# Altium project Juhtmevaba_arvutihiir.PrjPcb
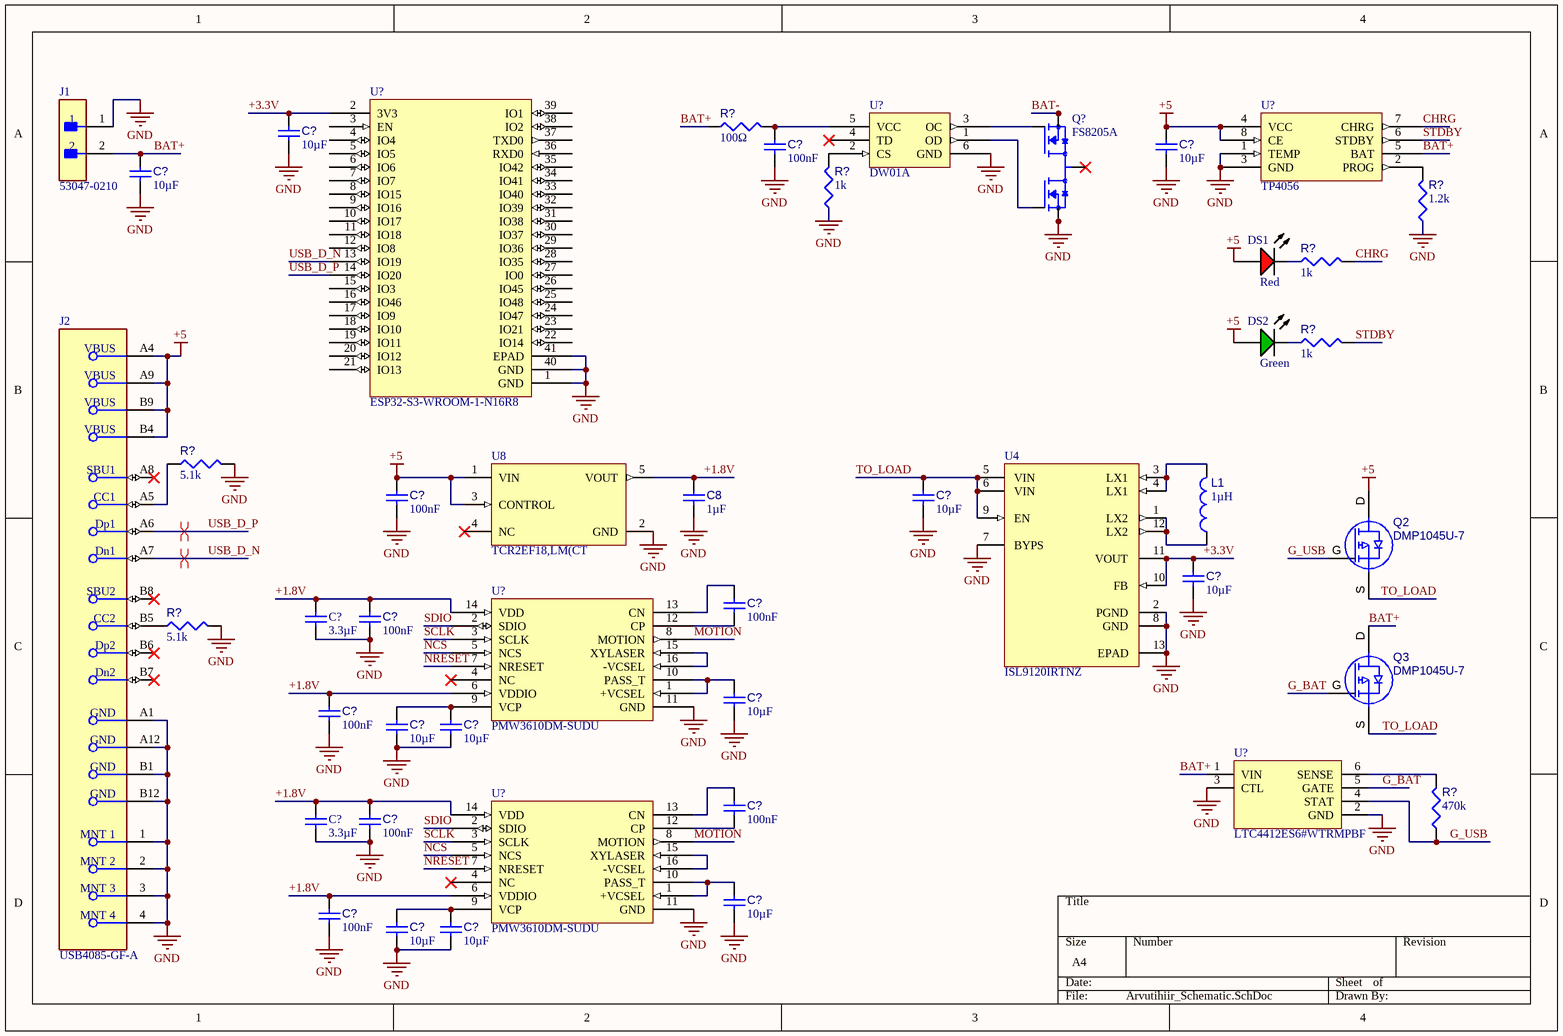
[diagram p0: Arvutihiir_Schematic.SchDoc]
1 sheet, 46 parts. Net scope: global (net labels, ports and power ports of the same name join across sheets).

## Sheet Arvutihiir_Schematic.SchDoc
size A4; SheetNumber: 1; SheetTotal: 1

### Parts
(Parts that share a designator on the sheet are numbered #1, #2 ... from top to bottom, then left to right.)
C8  value 1µF  [CAPC3216X180X50NL20T25]  (hidden comment: Capacitor 10 uF +/- 10% 16 V 1206)
C?#1  value 10µF  [CAPC0603(1608)100_L]  (hidden comment: Capacitor 10µF 0603)
C?#2  value 100nF  [CAPC1608X90X40ML10T20]  (hidden comment: Capacitor 100 nF +/-10% 50 V 0603)
C?#3  value 10µF  [CAPC0603(1608)100_L]  (hidden comment: Capacitor 10µF 0603)
C?#4  value 10µF  [CAPC0603(1608)100_L]  (hidden comment: Capacitor 10µF 0603)
C?#5  value 100nF  [CAPC1608X90X40ML10T20]  (hidden comment: Capacitor 100 nF +/-10% 50 V 0603)
C?#6  value 10µF  [CAPC0603(1608)100_L]  (hidden comment: Capacitor 10µF 0603)
C?#7  value 10µF  [CAPC0603(1608)100_L]  (hidden comment: Capacitor 10µF 0603)
C?#8  value 3.3µF  [CAPC1608X90X35ML15T15]  (hidden comment: Capacitor 3.3 µF 0603)
C?#9  value 100nF  [CAPC1608X90X40ML10T20]  (hidden comment: Capacitor 100 nF +/-10% 50 V 0603)
C?#10  value 100nF  [CAPC1608X90X40ML10T20]  (hidden comment: Capacitor 100 nF +/-10% 50 V 0603)
C?#11  value 10µF  [CAPC0603(1608)100_L]  (hidden comment: Capacitor 10µF 0603)
C?#12  value 100nF  [CAPC1608X90X40ML10T20]  (hidden comment: Capacitor 100 nF +/-10% 50 V 0603)
C?#13  value 10µF  [CAPC0603(1608)100_L]  (hidden comment: Capacitor 10µF 0603)
C?#14  value 10µF  [CAPC0603(1608)100_L]  (hidden comment: Capacitor 10µF 0603)
C?#15  value 3.3µF  [CAPC1608X90X35ML15T15]  (hidden comment: Capacitor 3.3 µF 0603)
C?#16  value 100nF  [CAPC1608X90X40ML10T20]  (hidden comment: Capacitor 100 nF +/-10% 50 V 0603)
C?#17  value 100nF  [CAPC1608X90X40ML10T20]  (hidden comment: Capacitor 100 nF +/-10% 50 V 0603)
C?#18  value 10µF  [CAPC0603(1608)100_L]  (hidden comment: Capacitor 10µF 0603)
C?#19  value 100nF  [CAPC1608X90X40ML10T20]  (hidden comment: Capacitor 100 nF +/-10% 50 V 0603)
C?#20  value 10µF  [CAPC0603(1608)100_L]  (hidden comment: Capacitor 10µF 0603)
C?#21  value 10µF  [CAPC0603(1608)100_L]  (hidden comment: Capacitor 10µF 0603)
DS1  Red  [LTST-C170KRKT_V]
DS2  Green  [LTST-LTST-C170KGKT-2_V]
J1  53047-0210  [FP-53047-0210-MFG]
J2  USB4085-GF-A  [FP-USB4085-GF-A-MFG]
L1  value 1µH  [INDC2520X120X60NL20T20]  (hidden comment: LQM2HPN1R0MJ0L)
Q2  DMP1045U-7
Q3  DMP1045U-7
Q?  FS8205A  [SOP65P640X120-8N]
R?#1  value 100Ω  [RESC1608X55X25ML10T15]  (hidden comment: Resistor 100Ω 0603)
R?#2  value 1k  [FP-MCT0603-IPC_A]  (hidden comment: Resistor 1k 0603)
R?#3  value 1.2k  [RESC0603(1608)_M]  (hidden comment: Resistor 1.2k 0603)
R?#4  value 1k  [FP-MCT0603-IPC_A]  (hidden comment: Resistor 1k 0603)
R?#5  value 1k  [FP-MCT0603-IPC_A]  (hidden comment: Resistor 1k 0603)
R?#6  value 5.1k  [FP-RMCF0603-IPC_A]  (hidden comment: Resistor 5.1k 0603)
R?#7  value 5.1k  [FP-RMCF0603-IPC_A]  (hidden comment: Resistor 5.1k 0603)
R?#8  value 470k  [FP-MCT0603-IPC_A]  (hidden comment: Resistor 470k 0603)
U4  ISL9120IRTNZ  [L12_3x3A_MFG]
U8  TCR2EF18,LM(CT  [FP-SSOP5-P-0_95-MFG]
U?#1  ESP32-S3-WROOM-1-N16R8  [QFN127P1800X1950X325_HS-53N]
U?#2  DW01A  [SOT95P280X120-6N]
U?#3  TP4056  [SOP127P600-8N]
U?#4  PMW3610DM-SUDU  [Copy of NE0016A]
U?#5  LTC4412ES6#WTRMPBF  [FP-S6-6-05-08-1636-IPC_A]
U?#6  PMW3610DM-SUDU  [Copy of NE0016A]

### Nets
+5: C?#3.2 C?#5.2 DS1.1(A) DS2.2(A) J2.A4(VBUS) J2.A9(VBUS) J2.B4(VBUS) J2.B9(VBUS) Q2.D U8.1(VIN) U8.3(CONTROL) U?#3.4(VCC) U?#3.8(CE)
GND: C8.2 C?#1.1 C?#2.1 C?#3.1 C?#4.1 C?#5.1 C?#6.1 C?#7.1 C?#8.1 C?#10.1 C?#11.1 C?#12.1 C?#13.1 C?#14.1 C?#15.1 C?#17.1 C?#18.1 C?#19.1 C?#20.1 C?#21.1 J1.1 J2.1(MNT_1) J2.2(MNT_2) J2.3(MNT_3) J2.4(MNT_4) J2.A1(GND) J2.A12(GND) J2.B1(GND) J2.B12(GND) Q?.2(S1) Q?.3(S1) R?#2.1 R?#3.1 R?#6.2 R?#7.2 U4.2(PGND) U4.7(BYPS) U4.8(GND) U4.13(EPAD) U8.2(GND) U?#1.1(GND) U?#1.40(GND) U?#1.41(EPAD) U?#2.6(GND) U?#3.1(TEMP) U?#3.3(GND) U?#4.11(GND) U?#5.2(GND) U?#5.3(CTL) U?#6.11(GND)
+1.8V: C8.1 C?#8.2 C?#10.2 C?#12.2 C?#15.2 C?#17.2 C?#19.2 U8.5(VOUT) U?#4.6(VDDIO) U?#4.14(VDD) U?#6.6(VDDIO) U?#6.14(VDD)
+3.3V: C?#1.2 C?#7.2 U4.10(FB) U4.11(VOUT) U?#1.2(3V3)
BAT+: C?#4.2 J1.2 Q3.D R?#1.1 U?#3.5(BAT) U?#5.1(VIN)
BAT-: Q?.6(S2) Q?.7(S2)
CHRG: R?#4.2 U?#3.7(CHRG)
G_BAT: Q3.G U?#5.5(GATE)
G_USB: Q2.G R?#8.1 U?#5.4(STAT)
MOTION: U?#4.8(MOTION) U?#6.8(MOTION)
NCS: U?#4.5(NCS) U?#6.5(NCS)
NRESET: U?#4.7(NRESET) U?#6.7(NRESET)
SCLK: U?#4.3(SCLK) U?#6.3(SCLK)
SDIO: U?#4.2(SDIO) U?#6.2(SDIO)
STDBY: R?#5.2 U?#3.6(STDBY)
TO_LOAD: C?#6.2 Q2.S Q3.S U4.5(VIN) U4.6(VIN) U4.9(EN)
USB_D_N: J2.A7(Dn1) U?#1.13(IO19)
USB_D_P: J2.A6(Dp1) U?#1.14(IO20)
NetC?#2_2: C?#2.2 R?#1.2 U?#2.5(VCC)
NetC?#9_1: C?#9.1 U?#4.12(CP)
NetC?#9_2: C?#9.2 U?#4.13(CN)
NetC?#11_2: C?#11.2 U?#4.1(+VCSEL) U?#4.10(PASS_T)
NetC?#13_2: C?#13.2 C?#14.2 U?#4.9(VCP)
NetC?#16_1: C?#16.1 U?#6.12(CP)
NetC?#16_2: C?#16.2 U?#6.13(CN)
NetC?#18_2: C?#18.2 U?#6.1(+VCSEL) U?#6.10(PASS_T)
NetC?#20_2: C?#20.2 C?#21.2 U?#6.9(VCP)
NetDS1_2: DS1.2(K) R?#4.1
NetDS2_1: DS2.1(K) R?#5.1
NetJ2_A5: J2.A5(CC1) R?#6.1
NetJ2_B5: J2.B5(CC2) R?#7.1
NetL1_1: L1.1 U4.1(LX2) U4.12(LX2)
NetL1_2: L1.2 U4.3(LX1) U4.4(LX1)
NetQ?_1: Q?.1(D12) Q?.8(D12)
NetQ?_4: Q?.4(G1) U?#2.1(OD)
NetQ?_5: Q?.5(G2) U?#2.3(OC)
NetR?#2_2: R?#2.2 U?#2.2(CS)
NetR?#3_2: R?#3.2 U?#3.2(PROG)
NetR?#8_2: R?#8.2 U?#5.6(SENSE)
NetU?#4_15: U?#4.15(XYLASER) U?#4.16(-VCSEL)
NetU?#6_15: U?#6.15(XYLASER) U?#6.16(-VCSEL)

Not connected (* = marked no-connect by the designer): J2 A8(SBU1)* B6(Dp2)* B7(Dn2)* B8(SBU2)*; U8 4(NC)*; U?#1 3(EN) 4(IO4) 5(IO5) 6(IO6) 7(IO7) 8(IO15) 9(IO16) 10(IO17) 11(IO18) 12(IO8) 15(IO3) 16(IO46) 17(IO9) 18(IO10) 19(IO11) 20(IO12) 21(IO13) 22(IO14) 23(IO21) 24(IO47) 25(IO48) 26(IO45) 27(IO0) 28(IO35) 29(IO36) 30(IO37) 31(IO38) 32(IO39) 33(IO40) 34(IO41) 35(IO42) 36(RXD0) 37(TXD0) 38(IO2) 39(IO1); U?#2 4(TD)*; U?#4 4(NC)*; U?#6 4(NC)*

### Layout directives
differential pair: USB_D_N, USB_D_P

### Library data of the parts
C8 = CMP-001-00016-6: Chip Capacitor, 10 uF, +/- 10%, 16 V, 1206 (3216 Metric); Capacitor Type: Ceramic; Voltage Rating: 16V; Tolerance: 10%; Min Operating Temperature: -55°C; Pins: 2; Mounting Technology: SM; Case/Package: 1206; Max Operating Temperature: 125°C; RoHS Compliant: True
C?#1 C?#3 C?#4 C?#6 C?#7 C?#11 C?#13 C?#14 C?#18 C?#20 C?#21 = CMP-001-00075-6: Chip Capacitor, 10µF +/-20%, 10V, 0603, Thickness 1 mm; Tolerance: 10%; Mounting Technology: SMT; Max Operating Temperature: 85°C; Case/Package: 0603; Voltage Rating: 10V; Min Operating Temperature: -55°C; Pins: 2
C?#2 C?#5 C?#9 C?#10 C?#12 C?#16 C?#17 C?#19 = CMP-001-00017-9: Chip Capacitor, 100 nF, +/- 10%, 50 V, 0603 (1608 Metric); Capacitor Type: Ceramic; Voltage Rating: 50V; Min Operating Temperature: -55°C; Case/Package: 0603; RoHS Compliant: True; Tolerance: 10%; Max Operating Temperature: 125°C; Mounting Technology: SM; Pins: 2
C?#8 C?#15 = CMP-001-00090-1: 3.3uF ±20% 6.3V X5R 0603 Multilayer Ceramic Capacitors MLCC - SMD/SMT RoHS; Mounting Technology: Surface Mount; Tolerance: 20%; Min Operating Temperature: -55°C; Voltage Rating: 6.3V; Pins: 2; Max Operating Temperature: 85°C; Case/Package: 0603
DS1 = CMP-2000-07593-1: LED Red, 75 mW, 54 mcd, -55 to 85 degC, 2-Pin SMD, RoHS, Tape and Reel; Manufacturer: Lite-On; Lens Transparency: Clear; Number of Elements: 1; Power Rating: 75mW; Luminous Intensity: 54mcd; Viewing Angle: 130degrees; Forward Current: 30mA; Wavelength: 639nm; Lens Style: Rectangular; Case\/Package: 0805; Test Current: 20mA; Dominant Wavelength: 631nm; Forward Voltage: 2V; Lens Colour: Colorless; Min Operating Temperature: -55degC; RoHSCompliant: True; Length: 3.2mm; Width: 1.25mm; Mount: SurfaceMount; Packaging: TapeandReel; Number of LEDs: 1; Radiation Hardening: No; Datasheet URL: http://optoelectronics.liteon.com/upload/download/DS-22-99-0150/LTST-C170KRKT.pdf; Datasheet Version: Rev. D, 11/2014; Case Code (Metric): 2012; Height: 1.1mm; Number of Pins: 2; Package Description: 2-Pin Surface Mount Device, Body 2 x 1.25 mm; Manufacturer URL: http://www.us.liteon.com/; Lead Free: LeadFree; Illumination Colour: Red; Colour: Red; Case Code (Imperial): 0805; Max Operating Temperature: 85degC; Power Dissipation: 75mW; Mounting Technology: SurfaceMount; Package Reference: C170KRKT; Package Quantity: 1; Depth: 1.6mm
DS2 = CMP-2000-06620-1: Ultra Bright AlInGaP Chip LED, 75 mW, -55 to 85 degC, 2-Pin SMD (0805), RoHS, Tape and Reel; Manufacturer: Lite-On; Forward Current: 30mA; Power Dissipation Max: 75mW; Emitting Color: YellowGreen; Type: Uni-Color; Forward Voltage: 2.4V; Dominant Wave Length: 571nm; Test Current (It): 20mA; Product Length (mm): 2mm; Peak Wavelength: 574nm; Power Dissipation: 75W; Product Depth (mm): 1.25mm; DELETED: Compliant; High Brightness: Yes; Product Height (mm): 1.1mm; Luminous Intensity: 35mcd; Shape Type: Rectangular; Chip Material: AlGaInP; Viewing Angle: 130deg; Number of  Elements: 1; Reverse Voltage: 5V; Rad Hardened: No; Package Type: ChipLed; Manufacturer URL: http://www.us.liteon.com/; Mounting: SurfaceMount; Operating Temp Range: -55Cto85C; Datasheet URL: http://optoelectronics.liteon.com/upload/download/DS22-2000-073/S_110_LTST-C170KGKT.pdf; Packaging: TapeandReel; Pin Count: 2; Package Description: 2-Pin Surface Mounted Device, Body 2 x 1.25 mm; Mounting Technology: SurfaceMount; Package Reference: LTST-C170KGKT-2; Forward Current Max: 30mA; Datasheet Version: Rev. G, 06/2005; Lens Dimensions: 1.4x1.25x0.6mm; Operating Temperature Classification: Industrial; Lum Intensity: 35mcd; Main Category: ChipLED
J1 = CMP-002-00079-1: PicoBlade 53047 2-Position Shrouded Header Male Blade 0.049" (1.25mm) Natural Through Hole; Voltage Rating: 125V; Max Current Rating: 1A; Gender: Male; Max Operating Temperature: 85°C; Min Operating Temperature: -40°C; Pins: 2; Mounting Technology: Through Hole
J2 = CMP-196119-000001-2: CONN RCPT USB2.0 TYPE C 24POS RA; Gender: Receptacle; Number of Positions: 16; USB Standard: USB 2.0; Orientation: Right Angle; Contact Plating: Gold; Contact Material: Copper Alloy
L1 = CMP-006-00008-6: Chip Inductor, 1 uH, +/- 20%, 1 MHz, -55 to 125 degC, 1008 (2520 Metric), RoHS, Tape and Reel; Manufacturer: Murata; Self Resonant Frequency: 70MHz; Current Rating: 1.5A; Shielding: Shielded; Core Material: Ferrite; Resistance: 0.09Ohm; Datasheet URL: http://psearch.en.murata.com/inductor/product/LQM2HPN1R0MJ0%23.pdf; Datasheet Version: Aug-16; RoHS Compliant: True; Case/Package: 1008; Package Description: 2-Pin Surface Mount Device, Body 2.5 x 2 mm; Package Quantity: 3000; Tolerance: 20%; Min Operating Temperature: -40°C; Package Reference: 1008; Packaging: TapeandReel; Mounting Technology: SM; Max Operating Temperature: 85°C
Q2 Q3 = CMP-013-00037-2: P-Channel 12 V 31 mOhm Surface Mount Enhancement Mode Mosfet - SOT-23-3; Max Operating Temperature: 150°C; Mounting Technology: Surface Mount; Pins: 3; Case/Package: SOT-23-3; Min Operating Temperature: -55°C
Q? = CMP-011-000000-4: Dual N-Channel Enhancement Mode Power MOSFET; MF: Fortune Semiconductor; SnapEDA_Link: https://www.snapeda.com/parts/FS8205A/Fortune+Semiconductor/view-part/?ref=snap; Component Type: Standard; Check_prices: https://www.snapeda.com/parts/FS8205A/Fortune+Semiconductor/view-part/?ref=eda; Pin Count: 8; Source: FS8205A.SchLib; MP: FS8205A; Design Item ID: FS8205A; Package: Package; Value: *
R?#1 = CMP-009-00189-1: RC Series 0603 0.1 W 100 Ohm ±5% ±100 ppm/°C SMT Thick Film Chip Resistor; Mounting Technology: Surface Mount; Tolerance: 5%; Min Operating Temperature: -55°C; Max Operating Temperature: 155°C; Case/Package: 0603
R?#2 R?#4 R?#5 = CMP-009-00184-2: SMD Chip Resistor, 1 kOhm, ± 0.1%, 125 mW, 0603 [1608 Metric], Thin Film, Precision; Voltage Rating: 75V; Tolerance: 0.1%; Min Operating Temperature: -55°C; Max Operating Temperature: 125°C; Case/Package: 0603; Mounting Technology: Surface Mount
R?#3 = CMP-009-00185-2: Fixed Resistor, Metal Glaze/thick Film, 0.1W, 1.2ohm, 75V, 1% +/-Tol, 100ppm/Cel, Surface Mount, 0603; Mounting Technology: Surface Mount; Min Operating Temperature: -55°C; Max Operating Temperature: 155°C; Case/Package: 0603; Tolerance: 1%
R?#6 R?#7 = CMP-009-00188-1: Res Thick Film 0603 5.1K Ohm 5% 1/10W ±200ppm/°C Molded SMD Paper T/R; Voltage Rating: 75V; Mounting Technology: Surface Mount; Case/Package: 0603; Min Operating Temperature: -55°C; Tolerance: 5%; Max Operating Temperature: 155°C
R?#8 = CMP-009-00187-1: Fixed Resistor, Thin Film, 0.1W, 470000ohm, 75V, 0.1% +/-Tol, 25ppm/Cel, Surface Mount, 0603; Case/Package: 0603; Min Operating Temperature: -55°C; Mounting Technology: Surface Mount; Max Operating Temperature: 125°C; Tolerance: 0.1%; Voltage Rating: 75V
U4 = CMP-019-00052-1: RoHS Compliant Buck-Boost 2005 Switching Regulator IC 85C 800mA 3.3V; Min Supply Voltage: 1.8V; Max Supply Voltage: 5.5V; Output Voltage: 3.3V; Output Current: 800mA; Max Operating Temperature: 85°C; Pins: 12; Min Operating Temperature: -40°C; Mounting Technology: Surface Mount
U8 = CMP-019-00053-2: LDO Voltage Regulators CMOS Point Regulator Single Output; Min Supply Voltage: 1.8V; Output Current: 150mA; Max Power Dissipation: 580mW; Dropout Voltage: 180mV; Max Supply Voltage: 5.5V; Nominal Supply Current: 35µA; Mounting Technology: Surface Mount; Output Voltage: 1.8V; Case/Package: SOT-25; Min Operating Temperature: -40°C; Max Operating Temperature: 85°C
U?#1 = CMP-020-00023-10: 2.4 GHz Wi-Fi, BLE 5, dual-core 32-bit LX7, Flash 16 MB, PSRAM 8 MB, 36 GPIOs, On-board PCB antenna; Min Supply Voltage: 3V; Max Supply Voltage: 3.6V; Max Operating Temperature: 65°C; Min Operating Temperature: -40°C
U?#2 = CMP-00029-00001-3: Built-In High Precision Voltage Detection Circuit and Delay Circuit; Max Operating Temperature: 85°C; Min Operating Temperature: -40°C; ComponentLink1Description: http://www.pingjingsemi.com/UploadFile/pdf/DW01A.pdf; Case/Package: SOT-23-6
U?#3 = CMP-019-00051-7: 1A Standalone Linear Li-lon Battery Charger with Thermal Regulation; Min Supply Voltage: -300mV; Max Supply Voltage: 8V; Max Operating Temperature: 85°C; Case/Package: SOP-8; ComponentLink1Description: https://www.alldatasheet.com/datasheet-pdf/pdf/1132405/ASIC/TP4056.html; Min Operating Temperature: -40°C
U?#4 U?#6 = CMP-010-00024-8: Low Power Laser Mouse Sensor, 1.7 – 2.1V, 12-bits motion data, Resolution up to 3200 cpi with 200 cpi step, 832-865nm wavelength VCSEL
U?#5 = CMP-016-00011-1: HOT-SWAP CTRL, -40 TO 85DEG C, TSOT-23-6; Available until stocks are exhausted; Min Supply Voltage: 2.5V; Max Supply Voltage: 28V; Max Operating Temperature: 85°C; Min Operating Temperature: -40°C; Pins: 6